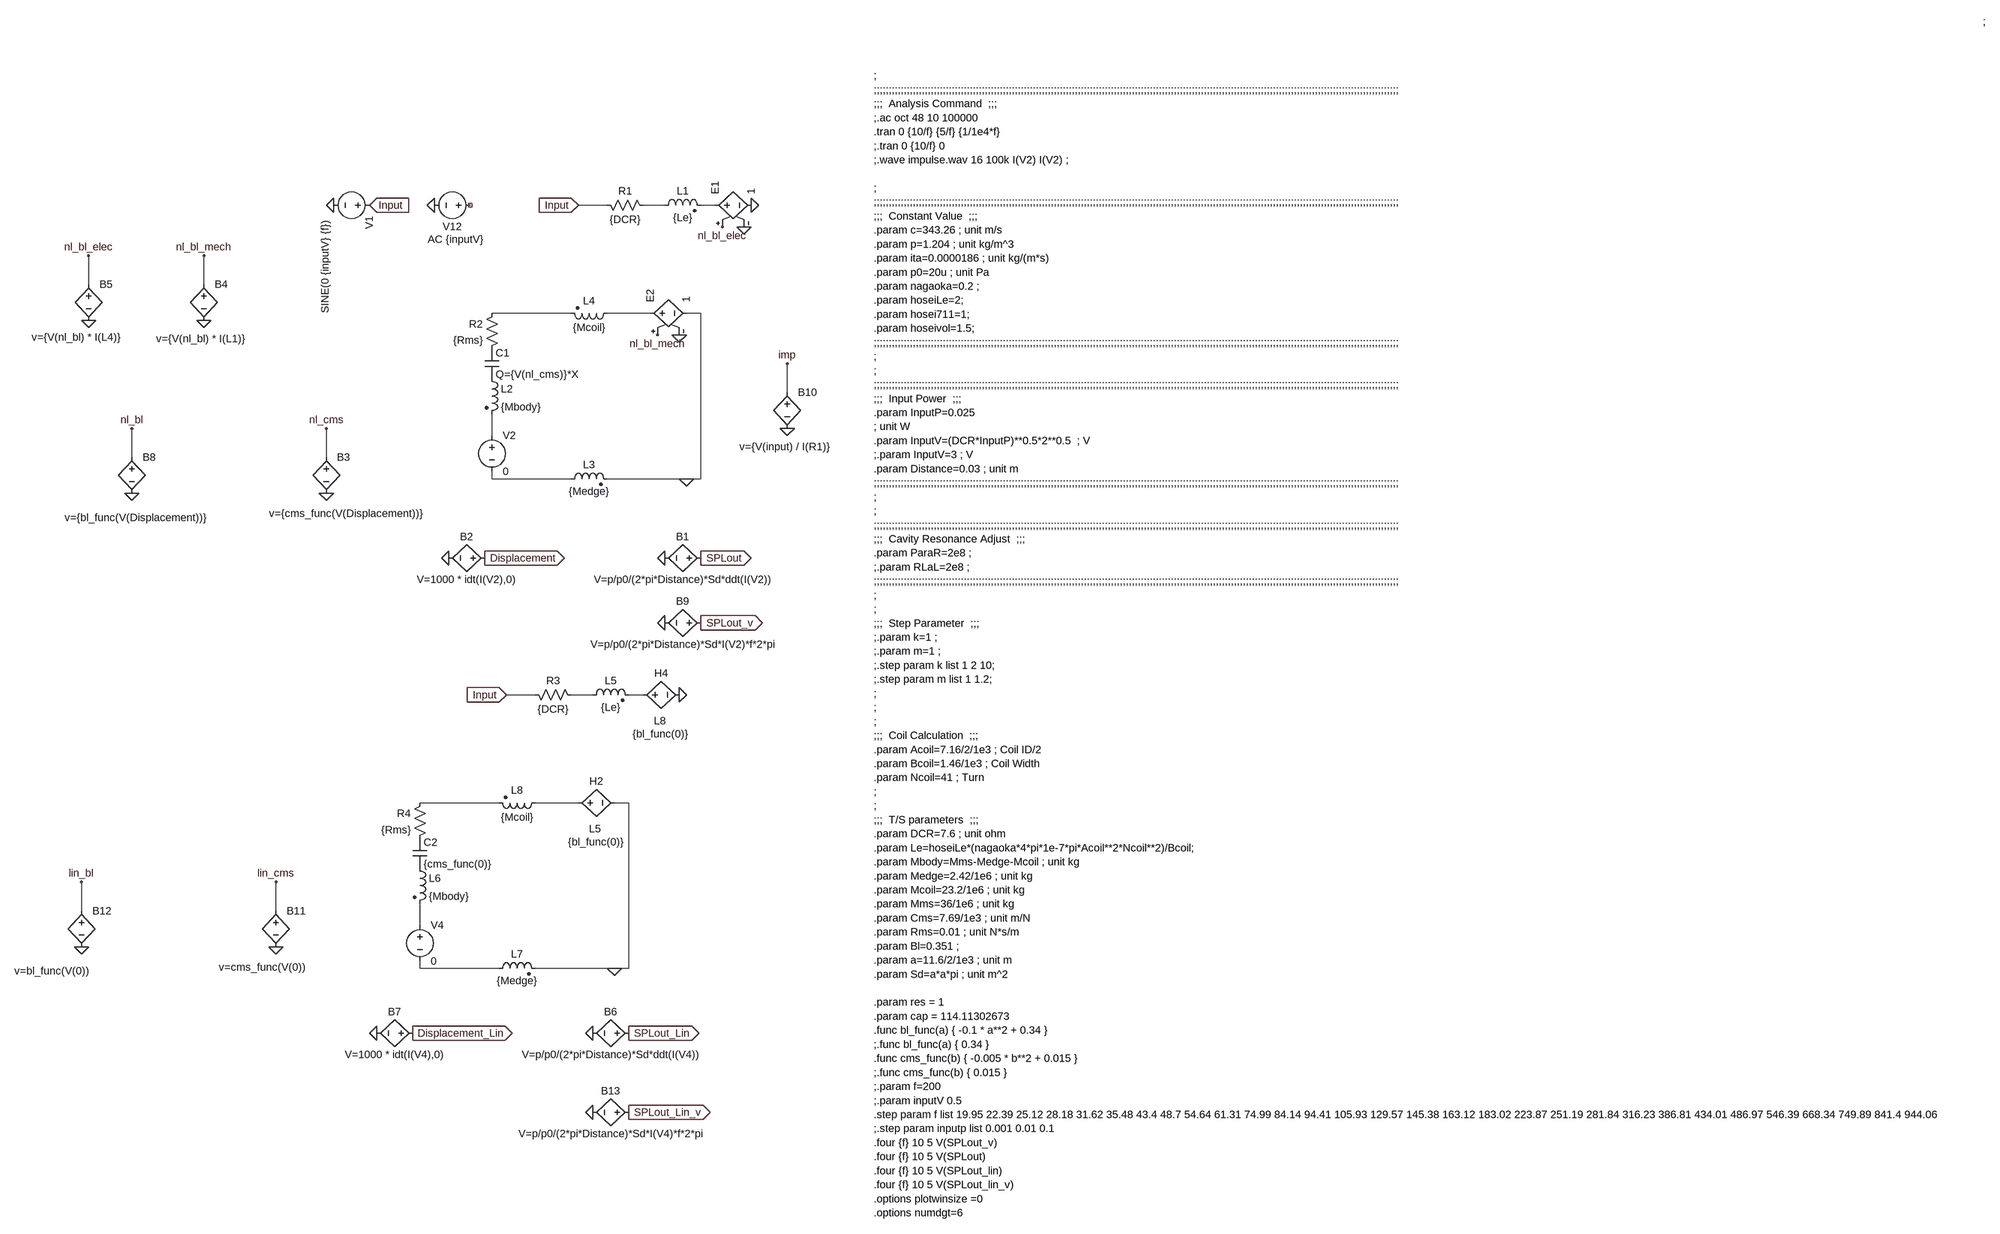
[diagram p0: schematic demo_11_25mw.asc]
demo_11_25mw.asc, the LTspice schematic file:
Version 4
SHEET 1 6896 9720
WIRE -2672 -416 -2736 -416
WIRE -2544 -416 -2592 -416
WIRE -2432 -416 -2464 -416
WIRE -3824 -240 -3824 -304
WIRE -3568 -240 -3568 -304
WIRE -2752 -176 -2928 -176
WIRE -2576 -176 -2672 -176
WIRE -2464 -176 -2496 -176
WIRE -2272 0 -2272 -64
WIRE -2928 96 -2928 48
WIRE -3728 144 -3728 80
WIRE -3296 144 -3296 80
WIRE -2928 192 -2928 176
WIRE -2752 192 -2928 192
WIRE -2496 192 -2672 192
WIRE -2464 192 -2464 -176
WIRE -2464 192 -2496 192
WIRE -2832 672 -2896 672
WIRE -2704 672 -2752 672
WIRE -2592 672 -2624 672
WIRE -2912 912 -3088 912
WIRE -2736 912 -2832 912
WIRE -2624 912 -2656 912
WIRE -3840 1152 -3840 1088
WIRE -3408 1152 -3408 1088
WIRE -3088 1184 -3088 1136
WIRE -3088 1280 -3088 1264
WIRE -2912 1280 -3088 1280
WIRE -2656 1280 -2832 1280
WIRE -2624 1280 -2624 912
WIRE -2624 1280 -2656 1280
FLAG -3056 -416 0
FLAG -3200 -416 Input
IOPIN -3200 -416 In
FLAG -2352 -416 0
FLAG -2736 -416 Input
IOPIN -2736 -416 In
FLAG -2496 192 0
FLAG -2464 368 SPLout
IOPIN -2464 368 Out
FLAG -2544 368 0
FLAG -2944 368 Displacement
IOPIN -2944 368 Out
FLAG -3024 368 0
FLAG -3280 -416 0
FLAG -3296 224 0
FLAG -3296 80 nl_cms
FLAG -3568 -160 0
FLAG -3568 -304 nl_bl_mech
FLAG -3824 -160 0
FLAG -3824 -304 nl_bl_elec
FLAG -2416 -368 nl_bl_elec
FLAG -2560 -128 nl_bl_mech
FLAG -2512 -128 0
FLAG -2368 -368 0
FLAG -2512 672 0
FLAG -2896 672 Input
IOPIN -2896 672 In
FLAG -2656 1280 0
FLAG -2624 1424 SPLout_Lin
IOPIN -2624 1424 Out
FLAG -2704 1424 0
FLAG -3104 1424 Displacement_Lin
IOPIN -3104 1424 Out
FLAG -3184 1424 0
FLAG -3728 224 0
FLAG -3728 80 nl_bl
FLAG -2464 512 SPLout_v
IOPIN -2464 512 Out
FLAG -2544 512 0
FLAG -2272 80 0
FLAG -2272 -64 imp
FLAG -3408 1232 0
FLAG -3408 1088 lin_cms
FLAG -3840 1232 0
FLAG -3840 1088 lin_bl
FLAG -2624 1600 SPLout_Lin_v
IOPIN -2624 1600 Out
FLAG -2704 1600 0
SYMBOL voltage -2960 -416 R90
WINDOW 0 32 56 VTop 2
WINDOW 3 -32 56 VBottom 2
WINDOW 123 60 48 VTop 2
SYMATTR InstName V12
SYMATTR Value ""
SYMATTR Value2 AC {inputV}
SYMBOL res -2688 -432 M90
WINDOW 0 0 56 VBottom 2
WINDOW 3 32 56 VTop 2
SYMATTR InstName R1
SYMATTR Value {DCR}
SYMBOL ind2 -2560 -400 R270
WINDOW 0 32 56 VTop 2
WINDOW 3 4 56 VBottom 2
SYMATTR InstName L1
SYMATTR Value {Le}
SYMATTR Type ind
SYMBOL res -2912 -192 M0
SYMATTR InstName R2
SYMATTR Value {Rms}
SYMBOL cap -2944 -96 R0
SYMATTR InstName C1
SYMATTR Value Q={V(nl_cms)}*X
SYMBOL h -2752 912 R270
WINDOW 0 32 56 VTop 2
WINDOW 3 -71 55 VBottom 2
WINDOW 38 -42 53 VBottom 2
SYMATTR InstName H2
SYMATTR Value {bl_func(0)}
SYMATTR SpiceModel L5
SYMBOL ind2 -2944 -48 R0
SYMATTR InstName L2
SYMATTR Value {Mbody}
SYMBOL voltage -2928 80 R0
SYMATTR InstName V2
SYMATTR Value 0
SYMBOL ind2 -2768 208 R270
WINDOW 0 32 56 VTop 2
WINDOW 3 4 56 VBottom 2
SYMATTR InstName L3
SYMATTR Value {Medge}
SYMBOL ind2 -2656 -192 R90
WINDOW 0 4 56 VBottom 2
WINDOW 3 32 56 VTop 2
SYMATTR InstName L4
SYMATTR Value {Mcoil}
SYMBOL bv -2448 368 R90
WINDOW 0 -32 56 VBottom 2
WINDOW 3 32 56 VTop 2
SYMATTR InstName B1
SYMATTR Value V=p/p0/(2*pi*Distance)*Sd*ddt(I(V2))
SYMBOL bv -2928 368 R90
WINDOW 0 -32 56 VBottom 2
WINDOW 3 32 56 VTop 2
SYMATTR InstName B2
SYMATTR Value V=1000 * idt(I(V2),0)
SYMBOL h -2608 672 R270
WINDOW 0 32 56 VTop 2
WINDOW 3 -71 55 VBottom 2
WINDOW 38 -42 53 VBottom 2
SYMATTR InstName H4
SYMATTR Value {bl_func(0)}
SYMATTR SpiceModel L8
SYMBOL voltage -3184 -416 R90
WINDOW 3 33 114 Left 2
WINDOW 123 24 38 Left 2
SYMATTR Value SINE(0 {inputV} {f})
SYMATTR InstName V1
SYMBOL bv -3296 128 R0
WINDOW 3 -127 141 Left 2
SYMATTR Value v={cms_func(V(Displacement))}
SYMATTR InstName B3
SYMBOL bv -3568 -256 R0
WINDOW 3 -106 137 Left 2
SYMATTR Value v={V(nl_bl) * I(L1)}
SYMATTR InstName B4
SYMBOL bv -3824 -256 R0
WINDOW 3 -127 133 Left 2
SYMATTR Value v={V(nl_bl) * I(L4)}
SYMATTR InstName B5
SYMBOL e -2448 -416 R270
SYMATTR InstName E1
SYMATTR Value 1
SYMBOL e -2592 -176 R270
SYMATTR InstName E2
SYMATTR Value 1
SYMBOL res -2848 656 M90
WINDOW 0 0 56 VBottom 2
WINDOW 3 32 56 VTop 2
SYMATTR InstName R3
SYMATTR Value {DCR}
SYMBOL ind2 -2720 688 R270
WINDOW 0 32 56 VTop 2
WINDOW 3 4 56 VBottom 2
SYMATTR InstName L5
SYMATTR Value {Le}
SYMATTR Type ind
SYMBOL res -3072 896 M0
SYMATTR InstName R4
SYMATTR Value {Rms}
SYMBOL cap -3104 992 R0
SYMATTR InstName C2
SYMATTR Value {cms_func(0)}
SYMBOL ind2 -3104 1040 R0
SYMATTR InstName L6
SYMATTR Value {Mbody}
SYMBOL voltage -3088 1168 R0
SYMATTR InstName V4
SYMATTR Value 0
SYMBOL ind2 -2928 1296 R270
WINDOW 0 32 56 VTop 2
WINDOW 3 4 56 VBottom 2
SYMATTR InstName L7
SYMATTR Value {Medge}
SYMBOL ind2 -2816 896 R90
WINDOW 0 4 56 VBottom 2
WINDOW 3 32 56 VTop 2
SYMATTR InstName L8
SYMATTR Value {Mcoil}
SYMBOL bv -2608 1424 R90
WINDOW 0 -32 56 VBottom 2
WINDOW 3 32 56 VTop 2
SYMATTR InstName B6
SYMATTR Value V=p/p0/(2*pi*Distance)*Sd*ddt(I(V4))
SYMBOL bv -3088 1424 R90
WINDOW 0 -32 56 VBottom 2
WINDOW 3 32 56 VTop 2
SYMATTR InstName B7
SYMATTR Value V=1000 * idt(I(V4),0)
SYMBOL bv -3728 128 R0
WINDOW 3 -149 150 Left 2
SYMATTR Value v={bl_func(V(Displacement))}
SYMATTR InstName B8
SYMBOL bv -2448 512 R90
WINDOW 0 -32 56 VBottom 2
WINDOW 3 32 56 VTop 2
SYMATTR InstName B9
SYMATTR Value V=p/p0/(2*pi*Distance)*Sd*I(V2)*f*2*pi
SYMBOL bv -2272 -16 R0
WINDOW 3 -106 137 Left 2
SYMATTR Value v={V(input) / I(R1)}
SYMATTR InstName B10
SYMBOL bv -3408 1136 R0
WINDOW 3 -127 141 Left 2
SYMATTR Value v=cms_func(V(0))
SYMATTR InstName B11
SYMBOL bv -3840 1136 R0
WINDOW 3 -149 150 Left 2
SYMATTR Value v=bl_func(V(0))
SYMATTR InstName B12
SYMBOL bv -2608 1600 R90
WINDOW 0 -32 56 VBottom 2
WINDOW 3 32 56 VTop 2
SYMATTR InstName B13
SYMATTR Value V=p/p0/(2*pi*Distance)*Sd*I(V4)*f*2*pi
TEXT -2080 -704 Left 2 !;\n;;;;;;;;;;;;;;;;;;;;;;;;;;;;;;;;;;;;;;;;;;;;;;;;;;;;;;;;;;;;;;;;;;;;;;;;;;;;;;;;;;;;;;;;;;;;;;;;;;;;;;;;;;;;;;;;;;;;;;;;;;;;;;;;;;;;;;;;;;;;;;;;;;;;;;;;;;;;;;;;;;;;;;;;;;;;;;;\n;;;  Analysis Command  ;;;\n;.ac oct 48 10 100000\n.tran 0 {10/f} {5/f} {1/1e4*f}\n;.tran 0 {10/f} 0\n;.wave impulse.wav 16 100k I(V2) I(V2) ;\n \n;\n;;;;;;;;;;;;;;;;;;;;;;;;;;;;;;;;;;;;;;;;;;;;;;;;;;;;;;;;;;;;;;;;;;;;;;;;;;;;;;;;;;;;;;;;;;;;;;;;;;;;;;;;;;;;;;;;;;;;;;;;;;;;;;;;;;;;;;;;;;;;;;;;;;;;;;;;;;;;;;;;;;;;;;;;;;;;;;;\n;;;  Constant Value  ;;;\n.param c=343.26 ; unit m/s\n.param p=1.204 ; unit kg/m^3\n.param ita=0.0000186 ; unit kg/(m*s)\n.param p0=20u ; unit Pa\n.param nagaoka=0.2 ; \n.param hoseiLe=2;\n.param hosei711=1;\n.param hoseivol=1.5;\n;;;;;;;;;;;;;;;;;;;;;;;;;;;;;;;;;;;;;;;;;;;;;;;;;;;;;;;;;;;;;;;;;;;;;;;;;;;;;;;;;;;;;;;;;;;;;;;;;;;;;;;;;;;;;;;;;;;;;;;;;;;;;;;;;;;;;;;;;;;;;;;;;;;;;;;;;;;;;;;;;;;;;;;;;;;;;;;\n;\n;\n;;;;;;;;;;;;;;;;;;;;;;;;;;;;;;;;;;;;;;;;;;;;;;;;;;;;;;;;;;;;;;;;;;;;;;;;;;;;;;;;;;;;;;;;;;;;;;;;;;;;;;;;;;;;;;;;;;;;;;;;;;;;;;;;;;;;;;;;;;;;;;;;;;;;;;;;;;;;;;;;;;;;;;;;;;;;;;;\n;;;  Input Power  ;;;\n.param InputP=0.025 \n; unit W\n.param InputV=(DCR*InputP)**0.5*2**0.5  ; V\n;.param InputV=3 ; V\n.param Distance=0.03 ; unit m\n;;;;;;;;;;;;;;;;;;;;;;;;;;;;;;;;;;;;;;;;;;;;;;;;;;;;;;;;;;;;;;;;;;;;;;;;;;;;;;;;;;;;;;;;;;;;;;;;;;;;;;;;;;;;;;;;;;;;;;;;;;;;;;;;;;;;;;;;;;;;;;;;;;;;;;;;;;;;;;;;;;;;;;;;;;;;;;;\n;\n;\n;;;;;;;;;;;;;;;;;;;;;;;;;;;;;;;;;;;;;;;;;;;;;;;;;;;;;;;;;;;;;;;;;;;;;;;;;;;;;;;;;;;;;;;;;;;;;;;;;;;;;;;;;;;;;;;;;;;;;;;;;;;;;;;;;;;;;;;;;;;;;;;;;;;;;;;;;;;;;;;;;;;;;;;;;;;;;;;\n;;;  Cavity Resonance Adjust  ;;;\n.param ParaR=2e8 ;\n;.param RLaL=2e8 ;\n;;;;;;;;;;;;;;;;;;;;;;;;;;;;;;;;;;;;;;;;;;;;;;;;;;;;;;;;;;;;;;;;;;;;;;;;;;;;;;;;;;;;;;;;;;;;;;;;;;;;;;;;;;;;;;;;;;;;;;;;;;;;;;;;;;;;;;;;;;;;;;;;;;;;;;;;;;;;;;;;;;;;;;;;;;;;;;;\n;\n;\n;;;  Step Parameter  ;;;\n;.param k=1 ;\n;.param m=1 ;\n;.step param k list 1 2 10;\n;.step param m list 1 1.2;\n;\n;\n;\n;;;  Coil Calculation  ;;;\n.param Acoil=7.16/2/1e3 ; Coil ID/2\n.param Bcoil=1.46/1e3 ; Coil Width\n.param Ncoil=41 ; Turn\n;\n;\n;;;  T/S parameters  ;;;\n.param DCR=7.6 ; unit ohm\n.param Le=hoseiLe*(nagaoka*4*pi*1e-7*pi*Acoil**2*Ncoil**2)/Bcoil; \n.param Mbody=Mms-Medge-Mcoil ; unit kg\n.param Medge=2.42/1e6 ; unit kg\n.param Mcoil=23.2/1e6 ; unit kg\n.param Mms=36/1e6 ; unit kg\n.param Cms=7.69/1e3 ; unit m/N\n.param Rms=0.01 ; unit N*s/m\n.param Bl=0.351 ;\n.param a=11.6/2/1e3 ; unit m\n.param Sd=a*a*pi ; unit m^2\n \n.param res = 1\n.param cap = 114.11302673\n.func bl_func(a) { -0.1 * a**2 + 0.34 }\n;.func bl_func(a) { 0.34 }\n.func cms_func(b) { -0.005 * b**2 + 0.015 }\n;.func cms_func(b) { 0.015 }\n;.param f=200\n;.param inputV 0.5\n.step param f list 19.95 22.39 25.12 28.18 31.62 35.48 43.4 48.7 54.64 61.31 74.99 84.14 94.41 105.93 129.57 145.38 163.12 183.02 223.87 251.19 281.84 316.23 386.81 434.01 486.97 546.39 668.34 749.89 841.4 944.06\n;.step param inputp list 0.001 0.01 0.1\n.four {f} 10 5 V(SPLout_v)\n.four {f} 10 5 V(SPLout)\n.four {f} 10 5 V(SPLout_lin)\n.four {f} 10 5 V(SPLout_lin_v) \n.options plotwinsize =0\n.options numdgt=6
TEXT 2064 -1288 Left 2 !;

The netlist it stands for:
* demo_11_25mw.asc
V12 NC_01 0 AC {inputV}
R1 Input N001 {DCR}
L1 N001 N002 {Le}
R2 N003 P001 {Rms}
C1 P001 P002 Q={V(nl_cms)}*X
H2 N010 0 L5 {bl_func(0)}
L2 P002 N005 {Mbody}
V2 N005 N006 0
L3 N006 0 {Medge}
L4 N004 N003 {Mcoil}
B1 SPLout 0 V=p/p0/(2*pi*Distance)*Sd*ddt(I(V2))
B2 Displacement 0 V=1000 * idt(I(V2),0)
H4 N008 0 L8 {bl_func(0)}
V1 Input 0 SINE(0 {inputV} {f})
B3 nl_cms 0 v={cms_func(V(Displacement))}
B4 nl_bl_mech 0 v={V(nl_bl) * I(L1)}
B5 nl_bl_elec 0 v={V(nl_bl) * I(L4)}
E1 N002 0 nl_bl_elec 0 1
E2 N004 0 nl_bl_mech 0 1
R3 Input N007 {DCR}
L5 N007 N008 {Le}
R4 N009 P003 {Rms}
C2 P003 P004 {cms_func(0)}
L6 P004 N011 {Mbody}
V4 N011 N012 0
L7 N012 0 {Medge}
L8 N010 N009 {Mcoil}
B6 SPLout_Lin 0 V=p/p0/(2*pi*Distance)*Sd*ddt(I(V4))
B7 Displacement_Lin 0 V=1000 * idt(I(V4),0)
B8 nl_bl 0 v={bl_func(V(Displacement))}
B9 SPLout_v 0 V=p/p0/(2*pi*Distance)*Sd*I(V2)*f*2*pi
B10 imp 0 v={V(input) / I(R1)}
B11 lin_cms 0 v=cms_func(V(0))
B12 lin_bl 0 v=bl_func(V(0))
B13 SPLout_Lin_v 0 V=p/p0/(2*pi*Distance)*Sd*I(V4)*f*2*pi
;
;;;;;;;;;;;;;;;;;;;;;;;;;;;;;;;;;;;;;;;;;;;;;;;;;;;;;;;;;;;;;;;;;;;;;;;;;;;;;;;;;;;;;;;;;;;;;;;;;;;;;;;;;;;;;;;;;;;;;;;;;;;;;;;;;;;;;;;;;;;;;;;;;;;;;;;;;;;;;;;;;;;;;;;;;;;;;;;
;;;  Analysis Command  ;;;
;.ac oct 48 10 100000
.tran 0 {10/f} {5/f} {1/1e4*f}
;.tran 0 {10/f} 0
;.wave impulse.wav 16 100k I(V2) I(V2) ;
;
;;;;;;;;;;;;;;;;;;;;;;;;;;;;;;;;;;;;;;;;;;;;;;;;;;;;;;;;;;;;;;;;;;;;;;;;;;;;;;;;;;;;;;;;;;;;;;;;;;;;;;;;;;;;;;;;;;;;;;;;;;;;;;;;;;;;;;;;;;;;;;;;;;;;;;;;;;;;;;;;;;;;;;;;;;;;;;;
;;;  Constant Value  ;;;
.param c=343.26 ; unit m/s
.param p=1.204 ; unit kg/m^3
.param ita=0.0000186 ; unit kg/(m*s)
.param p0=20u ; unit Pa
.param nagaoka=0.2 ;
.param hoseiLe=2;
.param hosei711=1;
.param hoseivol=1.5;
;;;;;;;;;;;;;;;;;;;;;;;;;;;;;;;;;;;;;;;;;;;;;;;;;;;;;;;;;;;;;;;;;;;;;;;;;;;;;;;;;;;;;;;;;;;;;;;;;;;;;;;;;;;;;;;;;;;;;;;;;;;;;;;;;;;;;;;;;;;;;;;;;;;;;;;;;;;;;;;;;;;;;;;;;;;;;;;
;
;
;;;;;;;;;;;;;;;;;;;;;;;;;;;;;;;;;;;;;;;;;;;;;;;;;;;;;;;;;;;;;;;;;;;;;;;;;;;;;;;;;;;;;;;;;;;;;;;;;;;;;;;;;;;;;;;;;;;;;;;;;;;;;;;;;;;;;;;;;;;;;;;;;;;;;;;;;;;;;;;;;;;;;;;;;;;;;;;
;;;  Input Power  ;;;
.param InputP=0.025
; unit W
.param InputV=(DCR*InputP)**0.5*2**0.5  ; V
;.param InputV=3 ; V
.param Distance=0.03 ; unit m
;;;;;;;;;;;;;;;;;;;;;;;;;;;;;;;;;;;;;;;;;;;;;;;;;;;;;;;;;;;;;;;;;;;;;;;;;;;;;;;;;;;;;;;;;;;;;;;;;;;;;;;;;;;;;;;;;;;;;;;;;;;;;;;;;;;;;;;;;;;;;;;;;;;;;;;;;;;;;;;;;;;;;;;;;;;;;;;
;
;
;;;;;;;;;;;;;;;;;;;;;;;;;;;;;;;;;;;;;;;;;;;;;;;;;;;;;;;;;;;;;;;;;;;;;;;;;;;;;;;;;;;;;;;;;;;;;;;;;;;;;;;;;;;;;;;;;;;;;;;;;;;;;;;;;;;;;;;;;;;;;;;;;;;;;;;;;;;;;;;;;;;;;;;;;;;;;;;
;;;  Cavity Resonance Adjust  ;;;
.param ParaR=2e8 ;
;.param RLaL=2e8 ;
;;;;;;;;;;;;;;;;;;;;;;;;;;;;;;;;;;;;;;;;;;;;;;;;;;;;;;;;;;;;;;;;;;;;;;;;;;;;;;;;;;;;;;;;;;;;;;;;;;;;;;;;;;;;;;;;;;;;;;;;;;;;;;;;;;;;;;;;;;;;;;;;;;;;;;;;;;;;;;;;;;;;;;;;;;;;;;;
;
;
;;;  Step Parameter  ;;;
;.param k=1 ;
;.param m=1 ;
;.step param k list 1 2 10;
;.step param m list 1 1.2;
;
;
;
;;;  Coil Calculation  ;;;
.param Acoil=7.16/2/1e3 ; Coil ID/2
.param Bcoil=1.46/1e3 ; Coil Width
.param Ncoil=41 ; Turn
;
;
;;;  T/S parameters  ;;;
.param DCR=7.6 ; unit ohm
.param Le=hoseiLe*(nagaoka*4*pi*1e-7*pi*Acoil**2*Ncoil**2)/Bcoil;
.param Mbody=Mms-Medge-Mcoil ; unit kg
.param Medge=2.42/1e6 ; unit kg
.param Mcoil=23.2/1e6 ; unit kg
.param Mms=36/1e6 ; unit kg
.param Cms=7.69/1e3 ; unit m/N
.param Rms=0.01 ; unit N*s/m
.param Bl=0.351 ;
.param a=11.6/2/1e3 ; unit m
.param Sd=a*a*pi ; unit m^2
.param res = 1
.param cap = 114.11302673
.func bl_func(a) { -0.1 * a**2 + 0.34 }
;.func bl_func(a) { 0.34 }
.func cms_func(b) { -0.005 * b**2 + 0.015 }
;.func cms_func(b) { 0.015 }
;.param f=200
;.param inputV 0.5
.step param f list 19.95 22.39 25.12 28.18 31.62 35.48 43.4 48.7 54.64 61.31 74.99 84.14 94.41 105.93 129.57 145.38 163.12 183.02 223.87 251.19 281.84 316.23 386.81 434.01 486.97 546.39 668.34 749.89 841.4 944.06
;.step param inputp list 0.001 0.01 0.1
.four {f} 10 5 V(SPLout_v)
.four {f} 10 5 V(SPLout)
.four {f} 10 5 V(SPLout_lin)
.four {f} 10 5 V(SPLout_lin_v)
.options plotwinsize =0
.options numdgt=6
;
.backanno
.end

* Results of the author's LTspice run, read from the files saved beside the schematic
* From the log:
*   N-Period=5
*   Fourier components of V(splout_v)
*   DC component:0.000422383
*   Harmonic  Frequency   Fourier   Normalized   Phase    Normalized
*    Number     [Hz]     Component   Component  [degree]  Phase [deg]
*       1     1.995e+01  2.059e+02  1.000e+00     87.21°      0.00°
*       2     3.990e+01  5.571e-03  2.706e-05    161.26°     74.05°
*       3     5.985e+01  1.473e+01  7.155e-02     73.28°    -13.94°
*       4     7.980e+01  2.199e-03  1.068e-05    131.11°     43.90°
*       5     9.975e+01  1.515e+00  7.357e-03     50.58°    -36.63°
*       6     1.197e+02  2.426e-03  1.178e-05    122.23°     35.02°
*       7     1.397e+02  2.031e-01  9.865e-04     22.77°    -64.44°
*       8     1.596e+02  3.061e-03  1.487e-05    106.97°     19.75°
*       9     1.795e+02  9.334e-02  4.534e-04     40.70°    -46.52°
*      10     1.995e+02  4.709e-03  2.288e-05     84.27°     -2.94°
*   Total Harmonic Distortion: 7.193489%(7.193630%)
*   N-Period=5
*   Fourier components of V(splout)
*   DC component:-0.012612
*   Harmonic  Frequency   Fourier   Normalized   Phase    Normalized
*    Number     [Hz]     Component   Component  [degree]  Phase [deg]
*       1     1.995e+01  2.059e+02  1.000e+00    177.17°      0.00°
*       2     3.990e+01  3.593e-02  1.745e-04    -95.95°   -273.12°
*       3     5.985e+01  4.419e+01  2.146e-01    163.18°    -13.99°
*       4     7.980e+01  3.161e-02  1.536e-04   -102.49°   -279.66°
*       5     9.975e+01  7.549e+00  3.667e-02    140.73°    -36.44°
*       6     1.197e+02  3.506e-02  1.703e-04   -110.93°   -288.10°
*       7     1.397e+02  1.376e+00  6.683e-03    113.62°    -63.55°
*       8     1.596e+02  3.982e-02  1.934e-04   -126.37°   -303.54°
*       9     1.795e+02  8.054e-01  3.913e-03    132.75°    -44.42°
*      10     1.995e+02  5.110e-02  2.482e-04   -156.88°   -334.05°
*   Total Harmonic Distortion: 21.789568%(21.799954%)
*   N-Period=5
*   Fourier components of V(splout_lin)
*   DC component:-6.30663e-005
*   Harmonic  Frequency   Fourier   Normalized   Phase    Normalized
*    Number     [Hz]     Component   Component  [degree]  Phase [deg]
*       1     1.995e+01  2.210e+02  1.000e+00    176.97°      0.00°
*       2     3.990e+01  1.309e-04  5.925e-07   -145.09°   -322.06°
*       3     5.985e+01  1.575e-02  7.128e-05    169.17°     -7.80°
*       4     7.980e+01  1.454e-04  6.579e-07    162.03°    -14.94°
*       5     9.975e+01  2.755e-02  1.247e-04   -129.14°   -306.10°
*       6     1.197e+02  1.708e-04  7.732e-07    111.75°    -65.22°
*       7     1.397e+02  3.545e-02  1.604e-04   -114.09°   -291.06°
*       8     1.596e+02  2.087e-04  9.444e-07     60.79°   -116.18°
*       9     1.795e+02  2.269e-02  1.027e-04   -119.39°   -296.36°
*      10     1.995e+02  2.352e-04  1.065e-06      0.23°   -176.74°
*   Total Harmonic Distortion: 0.023857%(0.033033%)
*   N-Period=5
*   Fourier components of V(splout_lin_v)
*   DC component:-3.96528e-007
*   Harmonic  Frequency   Fourier   Normalized   Phase    Normalized
*    Number     [Hz]     Component   Component  [degree]  Phase [deg]
*       1     1.995e+01  2.210e+02  1.000e+00     87.02°      0.00°
*       2     3.990e+01  2.730e-06  1.236e-08    147.17°     60.15°
*       3     5.985e+01  1.235e-03  5.588e-06    -18.02°   -105.04°
*       4     7.980e+01  6.004e-06  2.717e-08     90.11°      3.09°
*       5     9.975e+01  9.129e-04  4.131e-06     11.17°    -75.85°
*       6     1.197e+02  1.036e-05  4.691e-08     39.60°    -47.42°
*       7     1.397e+02  1.054e-03  4.769e-06     88.09°      1.07°
*       8     1.596e+02  1.500e-05  6.786e-08    -12.59°    -99.61°
*       9     1.795e+02  1.868e-03  8.456e-06     97.36°     10.34°
*      10     1.995e+02  1.610e-05  7.287e-08    -72.75°   -159.77°
*   Total Harmonic Distortion: 0.001194%(0.000000%)
*   N-Period=5
*   Fourier components of V(splout_v)
*   DC component:-0.00113352
*   Harmonic  Frequency   Fourier   Normalized   Phase    Normalized
*    Number     [Hz]     Component   Component  [degree]  Phase [deg]
*       1     2.239e+01  2.599e+02  1.000e+00     86.86°      0.00°
*       2     4.478e+01  1.003e-02  3.861e-05    179.74°     92.87°
*       3     6.717e+01  1.906e+01  7.335e-02     70.94°    -15.92°
*       4     8.956e+01  3.639e-03  1.400e-05    176.20°     89.34°
*       5     1.120e+02  2.301e+00  8.854e-03     45.04°    -41.83°
*       6     1.343e+02  2.911e-03  1.120e-05    152.80°     65.94°
*       7     1.567e+02  2.765e-01  1.064e-03    -21.43°   -108.29°
*       8     1.791e+02  2.970e-03  1.143e-05    104.85°     17.99°
*       9     2.015e+02  2.898e-01  1.115e-03      6.63°    -80.23°
*      10     2.239e+02  2.179e-03  8.382e-06     48.00°    -38.86°
*   Total Harmonic Distortion: 7.389699%(7.392359%)
*   N-Period=5
*   Fourier components of V(splout)
*   DC component:-0.00497915
*   Harmonic  Frequency   Fourier   Normalized   Phase    Normalized
*    Number     [Hz]     Component   Component  [degree]  Phase [deg]
*       1     2.239e+01  2.599e+02  1.000e+00    176.83°      0.00°
*       2     4.478e+01  2.999e-02  1.154e-04    -89.96°   -266.79°
*       3     6.717e+01  5.720e+01  2.201e-01    160.85°    -15.97°
*       4     8.956e+01  2.469e-02  9.498e-05    -92.22°   -269.05°
*       5     1.120e+02  1.149e+01  4.420e-02    135.16°    -41.67°
*       6     1.343e+02  2.691e-02  1.035e-04   -107.26°   -284.09°
*       7     1.567e+02  1.909e+00  7.345e-03     68.45°   -108.38°
*       8     1.791e+02  2.820e-02  1.085e-04   -145.35°   -322.18°
*       9     2.015e+02  2.578e+00  9.919e-03     96.77°    -80.05°
*      10     2.239e+02  1.685e-02  6.481e-05    164.22°    -12.60°
*   Total Harmonic Distortion: 22.481213%(22.611954%)
*   N-Period=5
*   Fourier components of V(splout_lin)
*   DC component:-6.31853e-005
*   Harmonic  Frequency   Fourier   Normalized   Phase    Normalized
*    Number     [Hz]     Component   Component  [degree]  Phase [deg]
*       1     2.239e+01  2.788e+02  1.000e+00    176.61°      0.00°
*       2     4.478e+01  8.114e-05  2.910e-07    -75.48°   -252.09°
*       3     6.717e+01  2.428e-02  8.707e-05   -127.39°   -303.99°
*       4     8.956e+01  1.569e-04  5.628e-07    -55.26°   -231.86°
*       5     1.120e+02  7.239e-02  2.596e-04   -125.29°   -301.89°
*       6     1.343e+02  3.425e-04  1.228e-06   -100.22°   -276.83°
*       7     1.567e+02  2.879e-02  1.032e-04   -169.69°   -346.30°
*       8     1.791e+02  3.876e-04  1.390e-06   -161.66°   -338.27°
*       9     2.015e+02  1.264e-02  4.533e-05     -9.97°   -186.58°
*      10     2.239e+02  1.707e-04  6.122e-07    155.47°    -21.14°
*   Total Harmonic Distortion: 0.029613%(0.033586%)
*   N-Period=5
*   Fourier components of V(splout_lin_v)
*   DC component:3.34198e-006
*   Harmonic  Frequency   Fourier   Normalized   Phase    Normalized
*    Number     [Hz]     Component   Component  [degree]  Phase [deg]
*       1     2.239e+01  2.788e+02  1.000e+00     86.65°      0.00°
*       2     4.478e+01  1.388e-05  4.978e-08    106.60°     19.95°
*       3     6.717e+01  3.845e-03  1.379e-05    -22.38°   -109.03°
*       4     8.956e+01  1.048e-05  3.759e-08     37.36°    -49.29°
*       5     1.120e+02  3.223e-03  1.156e-05    136.34°     49.69°
*       6     1.343e+02  1.266e-05  4.540e-08    131.74°     45.09°
*       7     1.567e+02  2.245e-03  8.050e-06    100.84°     14.19°
*       8     1.791e+02  3.760e-05  1.349e-07     83.02°     -3.63°
*       9     2.015e+02  1.685e-03  6.042e-06    -87.50°   -174.15°
*      10     2.239e+02  2.188e-05  7.847e-08     32.24°    -54.41°
*   Total Harmonic Distortion: 0.002062%(0.000000%)
*   N-Period=5
*   Fourier components of V(splout_v)
*   DC component:-0.014741
*   Harmonic  Frequency   Fourier   Normalized   Phase    Normalized
*    Number     [Hz]     Component   Component  [degree]  Phase [deg]
*       1     2.512e+01  3.288e+02  1.000e+00     86.43°      0.00°
*       2     5.024e+01  8.934e-01  2.717e-03    -14.64°   -101.07°
*       3     7.536e+01  2.504e+01  7.616e-02     67.59°    -18.84°
*       4     1.005e+02  1.685e-01  5.124e-04    -31.61°   -118.04°
*       5     1.256e+02  2.867e+00  8.721e-03     36.35°    -50.08°
*       6     1.507e+02  8.018e-02  2.439e-04    -18.62°   -105.05°
*       7     1.758e+02  1.159e+00  3.526e-03   -168.40°   -254.83°
*       8     2.010e+02  7.258e-02  2.208e-04      8.88°    -77.55°
*       9     2.261e+02  1.083e+00  3.294e-03     85.71°     -0.73°
*      10     2.512e+02  3.910e-02  1.189e-04      0.79°    -85.64°
*   Total Harmonic Distortion: 7.685865%(7.689944%)
*   N-Period=5
*   Fourier components of V(splout)
*   DC component:0.0418425
*   Harmonic  Frequency   Fourier   Normalized   Phase    Normalized
*    Number     [Hz]     Component   Component  [degree]  Phase [deg]
*       1     2.512e+01  3.288e+02  1.000e+00    176.40°      0.00°
*       2     5.024e+01  1.868e+00  5.680e-03     75.95°   -100.44°
*       3     7.536e+01  7.518e+01  2.286e-01    157.46°    -18.94°
*       4     1.005e+02  7.454e-01  2.267e-03     61.57°   -114.83°
*       5     1.256e+02  1.439e+01  4.377e-02    126.15°    -50.24°
*       6     1.507e+02  5.592e-01  1.701e-03     74.08°   -102.31°
*       7     1.758e+02  8.039e+00  2.445e-02    -78.29°   -254.69°
*       8     2.010e+02  6.623e-01  2.014e-03     97.68°    -78.71°
*       9     2.261e+02  9.733e+00  2.960e-02    175.31°     -1.09°
*      10     2.512e+02  4.734e-01  1.440e-03     90.64°    -85.75°
*   Total Harmonic Distortion: 23.604232%(23.781763%)
*   N-Period=5
*   Fourier components of V(splout_lin)
*   DC component:0.000365564
*   Harmonic  Frequency   Fourier   Normalized   Phase    Normalized
*    Number     [Hz]     Component   Component  [degree]  Phase [deg]
*       1     2.512e+01  3.518e+02  1.000e+00    176.21°      0.00°
*       2     5.024e+01  4.739e-04  1.347e-06    102.28°    -73.93°
*       3     7.536e+01  3.008e-02  8.551e-05   -165.90°   -342.11°
*       4     1.005e+02  2.553e-04  7.257e-07   -152.30°   -328.50°
*       5     1.256e+02  2.455e-02  6.979e-05   -163.62°   -339.83°
*       6     1.507e+02  7.732e-04  2.198e-06   -116.10°   -292.31°
*       7     1.758e+02  9.720e-03  2.763e-05    -74.54°   -250.75°
*       8     2.010e+02  1.330e-03  3.781e-06   -128.40°   -304.61°
*       9     2.261e+02  3.258e-02  9.261e-05    -57.12°   -233.33°
*      10     2.512e+02  1.397e-03  3.971e-06   -162.63°   -338.84°
*   Total Harmonic Distortion: 0.014684%(0.019520%)
*   N-Period=5
*   Fourier components of V(splout_lin_v)
*   DC component:2.41169e-006
*   Harmonic  Frequency   Fourier   Normalized   Phase    Normalized
*    Number     [Hz]     Component   Component  [degree]  Phase [deg]
*       1     2.512e+01  3.518e+02  1.000e+00     86.23°      0.00°
*       2     5.024e+01  5.340e-05  1.518e-07    -14.95°   -101.19°
*       3     7.536e+01  3.015e-04  8.571e-07    144.75°     58.52°
*       4     1.005e+02  7.714e-05  2.193e-07    -42.65°   -128.88°
*       5     1.256e+02  1.788e-03  5.082e-06     56.89°    -29.34°
*       6     1.507e+02  6.851e-05  1.947e-07    -88.68°   -174.91°
*       7     1.758e+02  2.105e-03  5.984e-06     18.92°    -67.31°
*       8     2.010e+02  5.928e-05  1.685e-07   -175.22°   -261.45°
*       9     2.261e+02  1.357e-04  3.858e-07     59.30°    -26.94°
*      10     2.512e+02  4.192e-05  1.192e-07    108.83°     22.60°
*   Total Harmonic Distortion: 0.000792%(0.000000%)
*   N-Period=5
*   Fourier components of V(splout_v)
*   DC component:-0.0431459
*   Harmonic  Frequency   Fourier   Normalized   Phase    Normalized
*    Number     [Hz]     Component   Component  [degree]  Phase [deg]
*       1     2.818e+01  4.173e+02  1.000e+00     85.74°      0.00°
*       2     5.636e+01  1.637e-01  3.923e-04    -43.74°   -129.48°
*       3     8.454e+01  3.058e+01  7.326e-02     59.50°    -26.24°
*       4     1.127e+02  7.972e-02  1.910e-04    -92.43°   -178.17°
*       5     1.409e+02  3.059e+00  7.329e-03     30.05°    -55.69°
*       6     1.691e+02  8.025e-02  1.923e-04   -124.61°   -210.35°
*       7     1.973e+02  4.191e+00  1.004e-02    146.50°     60.77°
*       8     2.254e+02  7.387e-02  1.770e-04    176.66°     90.92°
*       9     2.536e+02  1.449e+00  3.473e-03     30.76°    -54.98°
*      10     2.818e+02  3.749e-02  8.984e-05    124.64°     38.90°
*   Total Harmonic Distortion: 7.439502%(7.441333%)
*   N-Period=5
*   Fourier components of V(splout)
*   DC component:0.0112676
*   Harmonic  Frequency   Fourier   Normalized   Phase    Normalized
*    Number     [Hz]     Component   Component  [degree]  Phase [deg]
*       1     2.818e+01  4.174e+02  1.000e+00    175.72°      0.00°
*       2     5.636e+01  3.444e-01  8.253e-04     48.69°   -127.04°
*       3     8.454e+01  9.179e+01  2.199e-01    149.40°    -26.32°
*       4     1.127e+02  3.197e-01  7.661e-04      1.38°   -174.34°
*       5     1.409e+02  1.527e+01  3.660e-02    119.97°    -55.75°
*       6     1.691e+02  4.711e-01  1.129e-03    -32.53°   -208.25°
*       7     1.973e+02  2.933e+01  7.027e-02   -123.62°   -299.34°
*       8     2.254e+02  5.707e-01  1.367e-03    -93.45°   -269.17°
*       9     2.536e+02  1.305e+01  3.128e-02    120.67°    -55.05°
*      10     2.818e+02  3.632e-01  8.702e-04   -147.95°   -323.68°
*   Total Harmonic Distortion: 23.586639%(23.661200%)
*   N-Period=5
*   Fourier components of V(splout_lin)
*   DC component:0.000975315
*   Harmonic  Frequency   Fourier   Normalized   Phase    Normalized
*    Number     [Hz]     Component   Component  [degree]  Phase [deg]
*       1     2.818e+01  4.441e+02  1.000e+00    175.74°      0.00°
*       2     5.636e+01  1.959e-03  4.411e-06     70.21°   -105.52°
*       3     8.454e+01  4.342e-02  9.779e-05    170.97°     -4.77°
*       4     1.127e+02  1.920e-03  4.323e-06     48.62°   -127.12°
*       5     1.409e+02  2.837e-02  6.388e-05   -133.33°   -309.07°
*       6     1.691e+02  1.933e-03  4.353e-06     17.71°   -158.03°
*       7     1.973e+02  2.628e-02  5.918e-05    -86.88°   -262.62°
*       8     2.254e+02  1.811e-03  4.077e-06    -28.43°   -204.17°
*       9     2.536e+02  1.802e-02  4.058e-05    -99.37°   -275.11°
*      10     2.818e+02  1.373e-03  3.093e-06    -61.27°   -237.01°
*   Total Harmonic Distortion: 0.013738%(0.017354%)
*   N-Period=5
*   Fourier components of V(splout_lin_v)
*   DC component:8.53566e-006
*   Harmonic  Frequency   Fourier   Normalized   Phase    Normalized
*    Number     [Hz]     Component   Component  [degree]  Phase [deg]
*       1     2.818e+01  4.440e+02  1.000e+00     85.76°      0.00°
*       2     5.636e+01  2.915e-05  6.565e-08     -7.35°    -93.11°
*       3     8.454e+01  2.631e-03  5.926e-06     21.38°    -64.39°
*       4     1.127e+02  5.806e-05  1.308e-07    -49.93°   -135.70°
*       5     1.409e+02  2.971e-03  6.691e-06     66.75°    -19.02°
*       6     1.691e+02  8.256e-05  1.859e-07    -88.99°   -174.75°
*       7     1.973e+02  1.710e-03  3.851e-06    132.91°     47.15°
*       8     2.254e+02  9.314e-05  2.097e-07   -164.29°   -250.05°
*       9     2.536e+02  4.684e-04  1.055e-06    149.78°     64.02°
*      10     2.818e+02  6.268e-05  1.412e-07    132.30°     46.53°
*   Total Harmonic Distortion: 0.000980%(0.000000%)
*   N-Period=5
*   Fourier components of V(splout_v)
*   DC component:-0.304934
*   Harmonic  Frequency   Fourier   Normalized   Phase    Normalized
*    Number     [Hz]     Component   Component  [degree]  Phase [deg]
*       1     3.162e+01  5.311e+02  1.000e+00     85.39°      0.00°
*       2     6.324e+01  4.333e+00  8.159e-03    -17.26°   -102.66°
*       3     9.486e+01  3.862e+01  7.272e-02     61.12°    -24.27°
*       4     1.265e+02  7.324e-01  1.379e-03     11.24°    -74.15°
*       5     1.581e+02  5.643e-01  1.063e-03    133.74°     48.35°
*       6     1.897e+02  6.472e-01  1.219e-03    -81.71°   -167.10°
*       7     2.213e+02  7.312e+00  1.377e-02    142.40°     57.01°
*       8     2.530e+02  6.214e-01  1.170e-03     86.73°      1.34°
*       9     2.846e+02  7.983e-01  1.503e-03    -96.74°   -182.13°
*      10     3.162e+02  4.906e-01  9.237e-04     -5.82°    -91.21°
*   Total Harmonic Distortion: 7.451760%(7.453719%)
*   N-Period=5
*   Fourier components of V(splout)
*   DC component:-0.0694444
*   Harmonic  Frequency   Fourier   Normalized   Phase    Normalized
*    Number     [Hz]     Component   Component  [degree]  Phase [deg]
*       1     3.162e+01  5.311e+02  1.000e+00    175.40°      0.00°
*       2     6.324e+01  8.544e+00  1.609e-02     72.50°   -102.89°
*       3     9.486e+01  1.158e+02  2.181e-01    151.08°    -24.32°
*       4     1.265e+02  2.818e+00  5.307e-03    101.65°    -73.75°
*       5     1.581e+02  2.939e+00  5.534e-03   -133.56°   -308.96°
*       6     1.897e+02  3.873e+00  7.292e-03      6.23°   -169.17°
*       7     2.213e+02  5.131e+01  9.661e-02   -127.62°   -303.02°
*       8     2.530e+02  4.973e+00  9.363e-03    178.24°      2.84°
*       9     2.846e+02  7.208e+00  1.357e-02     -8.18°   -183.58°
*      10     3.162e+02  4.778e+00  8.997e-03     84.00°    -91.40°
*   Total Harmonic Distortion: 24.001464%(24.073746%)
*   N-Period=5
*   Fourier components of V(splout_lin)
*   DC component:0.000193981
*   Harmonic  Frequency   Fourier   Normalized   Phase    Normalized
*    Number     [Hz]     Component   Component  [degree]  Phase [deg]
*       1     3.162e+01  5.612e+02  1.000e+00    175.21°      0.00°
*       2     6.324e+01  2.647e-03  4.717e-06    146.87°    -28.34°
*       3     9.486e+01  1.812e-02  3.228e-05    -93.20°   -268.41°
*       4     1.265e+02  3.283e-03  5.851e-06    128.56°    -46.65°
*       5     1.581e+02  1.806e-02  3.218e-05    -47.53°   -222.74°
*       6     1.897e+02  1.904e-03  3.393e-06     56.31°   -118.90°
*       7     2.213e+02  2.664e-02  4.748e-05    -80.10°   -255.30°
*       8     2.530e+02  4.430e-03  7.894e-06   -119.02°   -294.23°
*       9     2.846e+02  6.448e-03  1.149e-05    -84.26°   -259.47°
*      10     3.162e+02  3.257e-03  5.803e-06    172.13°     -3.08°
*   Total Harmonic Distortion: 0.006803%(0.008589%)
*   N-Period=5
*   Fourier components of V(splout_lin_v)
*   DC component:-4.19187e-005
*   Harmonic  Frequency   Fourier   Normalized   Phase    Normalized
*    Number     [Hz]     Component   Component  [degree]  Phase [deg]
*       1     3.162e+01  5.612e+02  1.000e+00     85.23°      0.00°
*       2     6.324e+01  7.006e-05  1.249e-07   -118.92°   -204.15°
*       3     9.486e+01  1.248e-03  2.224e-06    103.84°     18.61°
*       4     1.265e+02  1.148e-04  2.045e-07     63.13°    -22.09°
*       5     1.581e+02  5.493e-04  9.788e-07     -2.07°    -87.29°
*       6     1.897e+02  3.551e-04  6.328e-07    -40.42°   -125.65°
*       7     2.213e+02  1.437e-03  2.561e-06    138.17°     52.95°
*       8     2.530e+02  1.686e-04  3.004e-07    166.36°     81.13°
*       9     2.846e+02  8.715e-04  1.553e-06     42.04°    -43.18°
*      10     3.162e+02  1.775e-04  3.164e-07     13.02°    -72.20°
*   Total Harmonic Distortion: 0.000394%(0.002708%)
*   N-Period=5
*   Fourier components of V(splout_v)
*   DC component:0.0512259
*   Harmonic  Frequency   Fourier   Normalized   Phase    Normalized
*    Number     [Hz]     Component   Component  [degree]  Phase [deg]
*       1     3.548e+01  6.756e+02  1.000e+00     84.88°      0.00°
*       2     7.096e+01  4.292e+00  6.353e-03    -18.98°   -103.86°
*       3     1.064e+02  4.492e+01  6.650e-02     56.75°    -28.13°
*       4     1.419e+02  8.768e-01  1.298e-03    -72.25°   -157.13°
*       5     1.774e+02  2.592e+00  3.836e-03    -88.06°   -172.94°
*       6     2.129e+02  8.591e-01  1.272e-03    104.59°     19.71°
*       7     2.484e+02  5.372e-01  7.951e-04    121.35°     36.47°
*       8     2.838e+02  2.200e-01  3.256e-04      0.79°    -84.09°
*       9     3.193e+02  2.434e+00  3.603e-03     86.14°      1.26°
*      10     3.548e+02  1.225e-01  1.814e-04   -155.67°   -240.55°
*   Total Harmonic Distortion: 6.703784%(6.704426%)
*   N-Period=5
*   Fourier components of V(splout)
*   DC component:0.0824682
*   Harmonic  Frequency   Fourier   Normalized   Phase    Normalized
*    Number     [Hz]     Component   Component  [degree]  Phase [deg]
*       1     3.548e+01  6.756e+02  1.000e+00    174.86°      0.00°
*       2     7.096e+01  8.742e+00  1.294e-02     71.36°   -103.49°
*       3     1.064e+02  1.349e+02  1.997e-01    146.60°    -28.25°
*       4     1.419e+02  3.571e+00  5.285e-03     20.15°   -154.70°
*       5     1.774e+02  1.294e+01  1.915e-02      2.35°   -172.50°
*       6     2.129e+02  5.121e+00  7.580e-03   -167.31°   -342.17°
*       7     2.484e+02  3.657e+00  5.414e-03   -151.09°   -325.94°
*       8     2.838e+02  1.931e+00  2.859e-03     90.72°    -84.13°
*       9     3.193e+02  2.192e+01  3.244e-02    175.68°      0.82°
*      10     3.548e+02  1.083e+00  1.604e-03    -61.93°   -236.79°
*   Total Harmonic Distortion: 20.393886%(20.432800%)
*   N-Period=5
*   Fourier components of V(splout_lin)
*   DC component:0.000303189
*   Harmonic  Frequency   Fourier   Normalized   Phase    Normalized
*    Number     [Hz]     Component   Component  [degree]  Phase [deg]
*       1     3.548e+01  7.099e+02  1.000e+00    174.60°      0.00°
*       2     7.096e+01  7.604e-04  1.071e-06    152.07°    -22.54°
*       3     1.064e+02  2.205e-02  3.106e-05    168.31°     -6.29°
*       4     1.419e+02  8.613e-05  1.213e-07   -166.56°   -341.16°
*       5     1.774e+02  1.674e-02  2.359e-05   -160.10°   -334.70°
*       6     2.129e+02  1.914e-03  2.696e-06   -117.75°   -292.35°
*       7     2.484e+02  1.310e-02  1.845e-05    -79.66°   -254.26°
*       8     2.838e+02  1.024e-03  1.442e-06     67.77°   -106.83°
*       9     3.193e+02  1.603e-02  2.258e-05    -52.06°   -226.66°
*      10     3.548e+02  4.096e-04  5.770e-07     38.72°   -135.88°
*   Total Harmonic Distortion: 0.004881%(0.007915%)
*   N-Period=5
*   Fourier components of V(splout_lin_v)
*   DC component:-3.93153e-005
*   Harmonic  Frequency   Fourier   Normalized   Phase    Normalized
*    Number     [Hz]     Component   Component  [degree]  Phase [deg]
*       1     3.548e+01  7.099e+02  1.000e+00     84.62°      0.00°
*       2     7.096e+01  4.446e-05  6.264e-08     75.99°     -8.63°
*       3     1.064e+02  9.351e-04  1.317e-06      4.37°    -80.24°
*       4     1.419e+02  1.609e-04  2.266e-07    -19.72°   -104.34°
*       5     1.774e+02  1.768e-03  2.491e-06     -0.79°    -85.41°
*       6     2.129e+02  1.852e-04  2.609e-07    123.30°     38.68°
*       7     2.484e+02  1.303e-03  1.835e-06    -14.66°    -99.28°
*       8     2.838e+02  1.446e-04  2.037e-07      5.46°    -79.16°
*       9     3.193e+02  4.825e-04  6.796e-07     47.40°    -37.22°
*      10     3.548e+02  2.964e-05  4.175e-08    141.51°     56.89°
*   Total Harmonic Distortion: 0.000345%(0.000000%)
*   N-Period=5
*   Fourier components of V(splout_v)
*   DC component:-0.893255
*   Harmonic  Frequency   Fourier   Normalized   Phase    Normalized
*    Number     [Hz]     Component   Component  [degree]  Phase [deg]
*       1     4.340e+01  1.001e+03  1.000e+00     83.52°      0.00°
*       2     8.680e+01  7.078e+00  7.073e-03    -21.08°   -104.60°
*       3     1.302e+02  1.233e+02  1.232e-01     49.05°    -34.47°
*       4     1.736e+02  1.217e+00  1.217e-03     -4.01°    -87.53°
*       5     2.170e+02  2.982e+01  2.980e-02   -169.24°   -252.77°
*       6     2.604e+02  1.268e+00  1.268e-03   -179.45°   -262.98°
*       7     3.038e+02  1.235e+01  1.234e-02     70.85°    -12.68°
*       8     3.472e+02  1.046e+00  1.046e-03     64.51°    -19.02°
*       9     3.906e+02  5.707e+00  5.703e-03   -127.83°   -211.35°
*      10     4.340e+02  6.352e-01  6.348e-04   -100.59°   -184.12°
*   Total Harmonic Distortion: 12.772595%(12.777320%)